# EAGLE schematic picoKey_230406 (EAGLE 9.6.2)
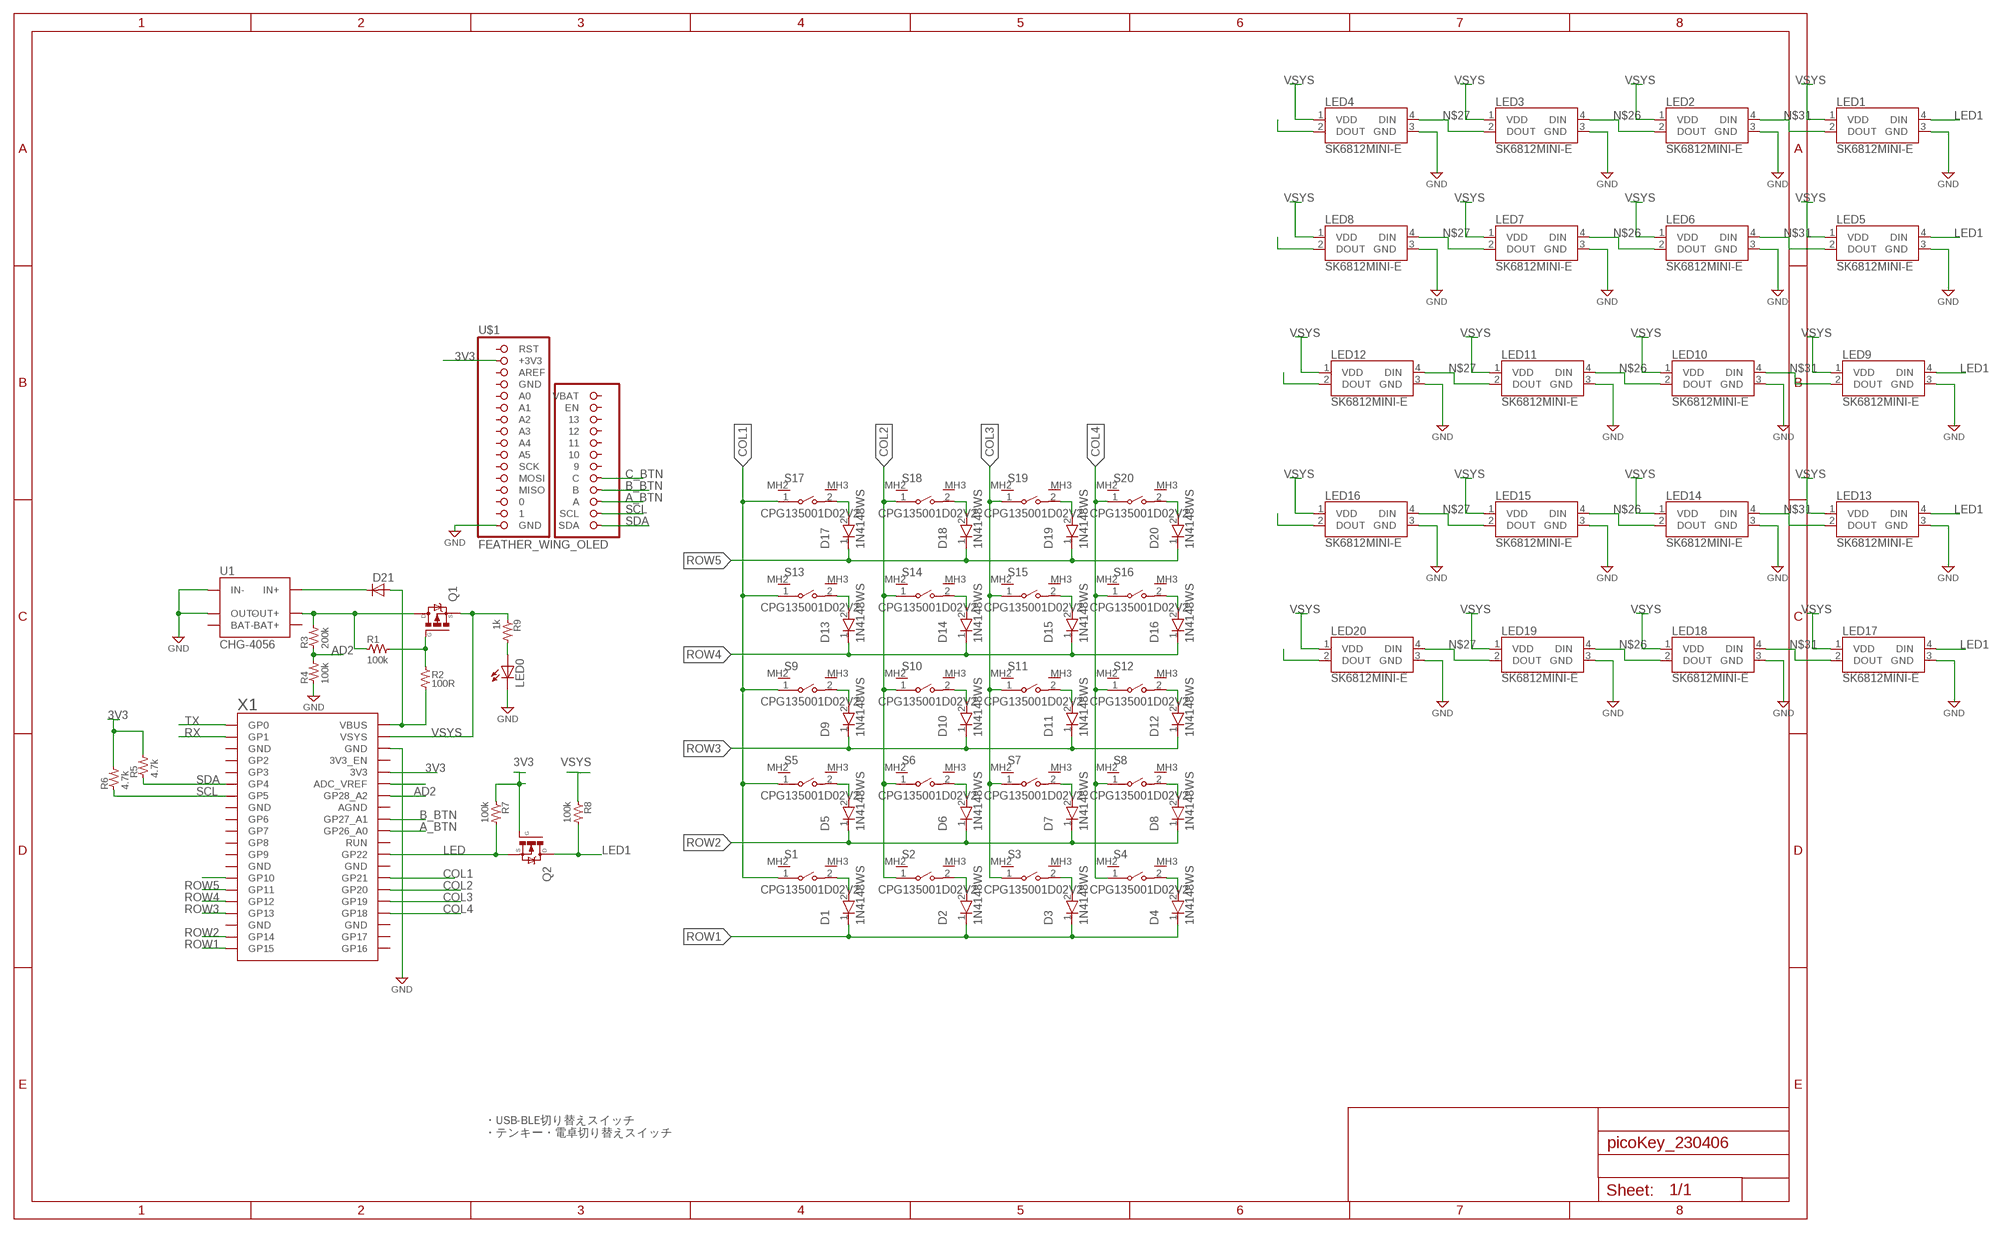
[diagram p0: schematic, sheet 1]

## Parts
D1  1N4148WS  [SODFL2512X90N]
D2  1N4148WS  [SODFL2512X90N]
D3  1N4148WS  [SODFL2512X90N]
D4  1N4148WS  [SODFL2512X90N]
D5  1N4148WS  [SODFL2512X90N]
D6  1N4148WS  [SODFL2512X90N]
D7  1N4148WS  [SODFL2512X90N]
D8  1N4148WS  [SODFL2512X90N]
D9  1N4148WS  [SODFL2512X90N]
D10  1N4148WS  [SODFL2512X90N]
D11  1N4148WS  [SODFL2512X90N]
D12  1N4148WS  [SODFL2512X90N]
D13  1N4148WS  [SODFL2512X90N]
D14  1N4148WS  [SODFL2512X90N]
D15  1N4148WS  [SODFL2512X90N]
D16  1N4148WS  [SODFL2512X90N]
D17  1N4148WS  [SODFL2512X90N]
D18  1N4148WS  [SODFL2512X90N]
D19  1N4148WS  [SODFL2512X90N]
D20  1N4148WS  [SODFL2512X90N]
D21  DIODE123  [SOD-123]
LED0  LEDCHIP-LED0603  [CHIP-LED0603]
LED1  SK6812MINI-E  [SK6812MINIE]
LED2  SK6812MINI-E  [SK6812MINIE]
LED3  SK6812MINI-E  [SK6812MINIE]
LED4  SK6812MINI-E  [SK6812MINIE]
LED5  SK6812MINI-E  [SK6812MINIE]
LED6  SK6812MINI-E  [SK6812MINIE]
LED7  SK6812MINI-E  [SK6812MINIE]
LED8  SK6812MINI-E  [SK6812MINIE]
LED9  SK6812MINI-E  [SK6812MINIE]
LED10  SK6812MINI-E  [SK6812MINIE]
LED11  SK6812MINI-E  [SK6812MINIE]
LED12  SK6812MINI-E  [SK6812MINIE]
LED13  SK6812MINI-E  [SK6812MINIE]
LED14  SK6812MINI-E  [SK6812MINIE]
LED15  SK6812MINI-E  [SK6812MINIE]
LED16  SK6812MINI-E  [SK6812MINIE]
LED17  SK6812MINI-E  [SK6812MINIE]
LED18  SK6812MINI-E  [SK6812MINIE]
LED19  SK6812MINI-E  [SK6812MINIE]
LED20  SK6812MINI-E  [SK6812MINIE]
Q1  MOSFET-P  [SOT-23]
Q2  MOSFET-NSOT-23  [SOT-23]
R1  100k  R_0603  [R0603]
R2  100R  R_0603  [R0603]
R3  200k  R_0603  [R0603]
R4  100k  R_0603  [R0603]
R5  4.7k  R_0603  [R0603]
R6  4.7k  R_0603  [R0603]
R7  100k  R_0603  [R0603]
R8  100k  R_0603  [R0603]
R9  1k  R_0603  [R0603]
S1  CPG135001D02V2  [KAILH_CHOC_V2]
S2  CPG135001D02V2  [KAILH_CHOC_V2]
S3  CPG135001D02V2  [KAILH_CHOC_V2]
S4  CPG135001D02V2  [KAILH_CHOC_V2]
S5  CPG135001D02V2  [KAILH_CHOC_V2]
S6  CPG135001D02V2  [KAILH_CHOC_V2]
S7  CPG135001D02V2  [KAILH_CHOC_V2]
S8  CPG135001D02V2  [KAILH_CHOC_V2]
S9  CPG135001D02V2  [KAILH_CHOC_V2]
S10  CPG135001D02V2  [KAILH_CHOC_V2]
S11  CPG135001D02V2  [KAILH_CHOC_V2]
S12  CPG135001D02V2  [KAILH_CHOC_V2]
S13  CPG135001D02V2  [KAILH_CHOC_V2]
S14  CPG135001D02V2  [KAILH_CHOC_V2]
S15  CPG135001D02V2  [KAILH_CHOC_V2]
S16  CPG135001D02V2  [KAILH_CHOC_V2]
S17  CPG135001D02V2  [KAILH_CHOC_V2]
S18  CPG135001D02V2  [KAILH_CHOC_V2]
S19  CPG135001D02V2  [KAILH_CHOC_V2]
S20  CPG135001D02V2  [KAILH_CHOC_V2]
U1  CHG-4056  [CHG-4056]
U$1  FEATHER_WING_OLED  [FEATHER_WING_OLED]
X1  RASPBERRYPI_PICO_RPI_PICO_MY-MY  [RASPBERRYPI_PICO_RPI_PICO_MY]

## Nets
3V3: Q2.3(G) R5.2 R6.2 R7.1 U$1.15(+3V3) X1.3V3
A_BTN: U$1.26(A) X1.GP26_A0
AD2: R3.1 R4.2 X1.GP28_A2
B_BTN: U$1.25(B) X1.GP27_A1
C_BTN: U$1.24(C)
COL1: S1.1 S5.1 S9.1 S13.1 S17.1 X1.GP21
COL2: S2.1 S6.1 S10.1 S14.1 S18.1 X1.GP20
COL3: S3.1 S7.1 S11.1 S15.1 S19.1 X1.GP19
COL4: S4.1 S8.1 S12.1 S16.1 S20.1 X1.GP18
GND: LED0.C LED1.3(GND) LED2.3(GND) LED3.3(GND) LED4.3(GND) LED5.3(GND) LED6.3(GND) LED7.3(GND) LED8.3(GND) LED9.3(GND) LED10.3(GND) LED11.3(GND) LED12.3(GND) LED13.3(GND) LED14.3(GND) LED15.3(GND) LED16.3(GND) LED17.3(GND) LED18.3(GND) LED19.3(GND) LED20.3(GND) R4.1 U1.IN- U1.OUT- U$1.1(GND) X1.GND@8(GND) ; supply symbol labelled G
LED: Q2.1(S) R7.2 X1.GP22
LED1: LED1.4(DIN) LED5.4(DIN) LED9.4(DIN) LED13.4(DIN) LED17.4(DIN) Q2.2(D) R8.2
N$5: D1.2(A) S1.2
N$6: D2.2(A) S2.2
N$7: D3.2(A) S3.2
N$8: D4.2(A) S4.2
N$9: D5.2(A) S5.2
N$10: D6.2(A) S6.2
N$11: D7.2(A) S7.2
N$12: D8.2(A) S8.2
N$13: D9.2(A) S9.2
N$14: D10.2(A) S10.2
N$15: D11.2(A) S11.2
N$16: D12.2(A) S12.2
N$17: D13.2(A) S13.2
N$18: D14.2(A) S14.2
N$19: D15.2(A) S15.2
N$20: D16.2(A) S16.2
N$21: D17.2(A) S17.2
N$22: D18.2(A) S18.2
N$23: LED0.A R9.2
N$24: D20.2(A) S20.2
N$25: D19.2(A) S19.2
N$26: LED2.2(DOUT) LED3.4(DIN) LED6.2(DOUT) LED7.4(DIN) LED10.2(DOUT) LED11.4(DIN) LED14.2(DOUT) LED15.4(DIN) LED18.2(DOUT) LED19.4(DIN)
N$27: LED3.2(DOUT) LED4.4(DIN) LED7.2(DOUT) LED8.4(DIN) LED11.2(DOUT) LED12.4(DIN) LED15.2(DOUT) LED16.4(DIN) LED19.2(DOUT) LED20.4(DIN)
N$29: Q1.2(D) R1.1 R3.2 U1.OUT+
N$30: D21.A R2.2 X1.VBUS
N$31: LED1.2(DOUT) LED2.4(DIN) LED5.2(DOUT) LED6.4(DIN) LED9.2(DOUT) LED10.4(DIN) LED13.2(DOUT) LED14.4(DIN) LED17.2(DOUT) LED18.4(DIN)
N$32: D21.K(C) U1.IN+
N$33: LED4.2(DOUT)
N$34: LED8.2(DOUT)
N$35: LED12.2(DOUT)
N$36: Q1.3(G) R1.2 R2.1
N$37: LED16.2(DOUT)
N$38: LED20.2(DOUT)
N$40: X1.ADC_VREF
N$41: X1.GP10
ROW1: D1.1(K) D2.1(K) D3.1(K) D4.1(K) X1.GP15
ROW2: D5.1(K) D6.1(K) D7.1(K) D8.1(K) X1.GP14
ROW3: D9.1(K) D10.1(K) D11.1(K) D12.1(K) X1.GP13
ROW4: D13.1(K) D14.1(K) D15.1(K) D16.1(K) X1.GP12
ROW5: D17.1(K) D18.1(K) D19.1(K) D20.1(K) X1.GP11
RX: X1.GP1
SCL: R6.1 U$1.27(SCL) X1.GP5
SDA: R5.1 U$1.28(SDA) X1.GP4
TX: X1.GP0
VSYS: LED1.1(VDD) LED2.1(VDD) LED3.1(VDD) LED4.1(VDD) LED5.1(VDD) LED6.1(VDD) LED7.1(VDD) LED8.1(VDD) LED9.1(VDD) LED10.1(VDD) LED11.1(VDD) LED12.1(VDD) LED13.1(VDD) LED14.1(VDD) LED15.1(VDD) LED16.1(VDD) LED17.1(VDD) LED18.1(VDD) LED19.1(VDD) LED20.1(VDD) Q1.1(S) R8.1 R9.1 X1.VSYS
Unconnected: S1.MH2(MH) S1.MH3(MH) S2.MH2(MH) S2.MH3(MH) S3.MH2(MH) S3.MH3(MH) S4.MH2(MH) S4.MH3(MH) S5.MH2(MH) S5.MH3(MH) S6.MH2(MH) S6.MH3(MH) S7.MH2(MH) S7.MH3(MH) S8.MH2(MH) S8.MH3(MH) S9.MH2(MH) S9.MH3(MH) S10.MH2(MH) S10.MH3(MH) S11.MH2(MH) S11.MH3(MH) S12.MH2(MH) S12.MH3(MH) S13.MH2(MH) S13.MH3(MH) S14.MH2(MH) S14.MH3(MH) S15.MH2(MH) S15.MH3(MH) S16.MH2(MH) S16.MH3(MH) S17.MH2(MH) S17.MH3(MH) S18.MH2(MH) S18.MH3(MH) S19.MH2(MH) S19.MH3(MH) S20.MH2(MH) S20.MH3(MH) U1.BAT+ U1.BAT- U$1.2 U$1.3 U$1.4(MISO) U$1.5(MOSI) U$1.6(SCK) U$1.7(A5) U$1.8(A4) U$1.9(A3) U$1.10(A2) U$1.11(A1) U$1.12(A0) U$1.13(GND) U$1.14(AREF) U$1.16(RST) U$1.17(VBAT) U$1.18(EN) U$1.19 U$1.20 U$1.21 U$1.22 U$1.23 X1.3V3_EN X1.AGND X1.GND@1(GND) X1.GND@2(GND) X1.GND@3(GND) X1.GND@4(GND) X1.GND@6(GND) X1.GND@7(GND) X1.GP2 X1.GP3 X1.GP6 X1.GP7 X1.GP8 X1.GP9 X1.GP16 X1.GP17 X1.RUN

## Notes on the sheet
- ・USB-BLE切り替えスイッチ
  ・テンキー・電卓切り替えスイッチ

## Library data of the parts
D1-D20 = SamacSys_Parts:1N4148WS: ON Semiconductor Switching Diode, 300mA 75V, 2-Pin SOD-323 1N4148WS Source: Datasheet; ARROW_PART_NUMBER: 1N4148WS; ARROW_PRICE-STOCK: https://www.arrow.com/en/products/1n4148ws/on-semiconductor?region=europe; DESCRIPTION: ON Semiconductor Switching Diode, 300mA 75V, 2-Pin SOD-323 1N4148WS; HEIGHT: 0.9mm; MANUFACTURER_NAME: onsemi; MANUFACTURER_PART_NUMBER: 1N4148WS; MOUSER_PART_NUMBER: 512-1N4148WS; MOUSER_PRICE-STOCK: https://www.mouser.co.uk/ProductDetail/onsemi-Fairchild/1N4148WS?qs=2%2FYqgE%252BHg%252BKBrKZlAsMLhw%3D%3D
D21 = Miya_IC:DIODE: Diode
LED0 = Miya_IC:LED: LED OSRAM: - CHIPLED LG R971, LG N971, LY N971, LG Q971, LY Q971, LO R971, LY R971 LH N974, LH R974 LS Q976, LO Q976, LY Q976 LO Q996 - Hyper CHIPLED LW Q18S LB Q993, LB Q99A, LB R99A - SideLED LS A670, LO A670, LY A670, LG A670, LP A670 LB A673, LV A673, LT A673, LW A673 LH A674 LY A675 LS A676, LA A676, LO A676, LY A676, LW A676 LS A679, LY A679, LG A679 - Hyper Micro SIDELED® LS Y876, LA Y876, LO Y876, LY Y876 LT Y87S - SmartLED LW L88C, LW L88S LB L89C, LB L89S, LG L890 LS L89K, LO L89K, LY L89K LS L896, LA L896, LO L896, LY L896 - TOPLED LS T670, LO T670, LY T670, LG T670, LP T670 LSG T670, LSP T670, LSY T670, LOP T670, LYG T670 LG T671, LOG T671, LSG T671 LB T673, LV T673, LT T673, LW T673 LH T674 LS T676, LA T676, LO T676, LY T676, LB T676, LH T676, LSB T676, LW T676 LB T67C, LV T67C, LT T67C, LS T67K, LO T67K, LY T67K, LW E67C LS E67B, LA E67B, LO E67B, LY E67B, LB E67C, LV E67C, LT E67C LW T67C LS T679, LY T679, LG T679 LS T770, LO T770, LY T770, LG T770, LP T770 LB T773, LV T773, LT T773, LW T773 LH T774 LS E675, LA E675, LY E675, LS T675 LS T776, LA T776, LO T776, LY T776, LB T776 LHGB T686 LT T68C, LB T68C - Hyper Mini TOPLED® LB M676 - Mini TOPLED Santana® LG M470 LS M47K, LO M47K, LY M47K Source: http://www.osram.convergy.de - LUMILED® LXK2-PW12-R00, LXK2-PW12-S00, LXK2-PW14-U00, LXK2-PW14-V00 LXK2-PM12-R00, LXK2-PM12-S00, LXK2-PM14-U00 LXK2-PE12-Q00, LXK2-PE12-R00, LXK2-PE12-S00, LXK2-PE14-T00, LXK2-PE14-U00 LXK2-PB12-K00, LXK2-PB12-L00, LXK2-PB12-M00, LXK2-PB14-N00, LXK2-PB14-P00, LXK2-PB14-Q00 LXK2-PR12-L00, LXK2-PR12-M00, LXK2-PR14-Q00, LXK2-PR14-R00 LXK2-PD12-Q00, LXK2-PD12-R00, LXK2-PD12-S00 LXK2-PH12-R00, LXK2-PH12-S00 LXK2-PL12-P00, LXK2-PL12-Q00, LXK2-PL12-R00 Source: www.luxeon.com
LED1-LED20 = picoKey:SK6812MINI-E: 3.2x2.8x1.78 mm 0.2W Intelligent external control surface mount SMD LED (MSL:5a) Source: Datasheet <http://yushakobo.jp/ds/YS-SK6812MINI-E.pdf>; DESCRIPTION: 3.2x2.8x1.78 mm 0.2W Intelligent external control surface mount SMD LED (MSL:5a); HEIGHT: 1.88mm; MANUFACTURER_NAME: Yellow Stone Corp.; MANUFACTURER_PART_NUMBER: SK6812MINI-E
Q1 = Miya_IC:MOSFET-P: P-CHANNEL HEXFET POWER-MOS-FET Source: http://www.irf.com/product-info/datasheets/data/irf9530.pdf
Q2 = Miya_IC:MOSFET-N: HEXFET Power MOSFET
R1-R9 = Miya_IC:R_: RESISTOR
S1-S20 = picoKey:CPG135001D02: Through Hole Tactile Switches RoHS Source: Datasheet <https://datasheet.lcsc.com/szlcsc/1910111742_Kailh-CPG135001D02_C400230.pdf>
U1 = picoKey:CHG-4056
U$1 = picoKey:FEATHER_WING_OLED
X1 = picoKey:RASPBERRYPI_PICO_RPI_PICO_MY